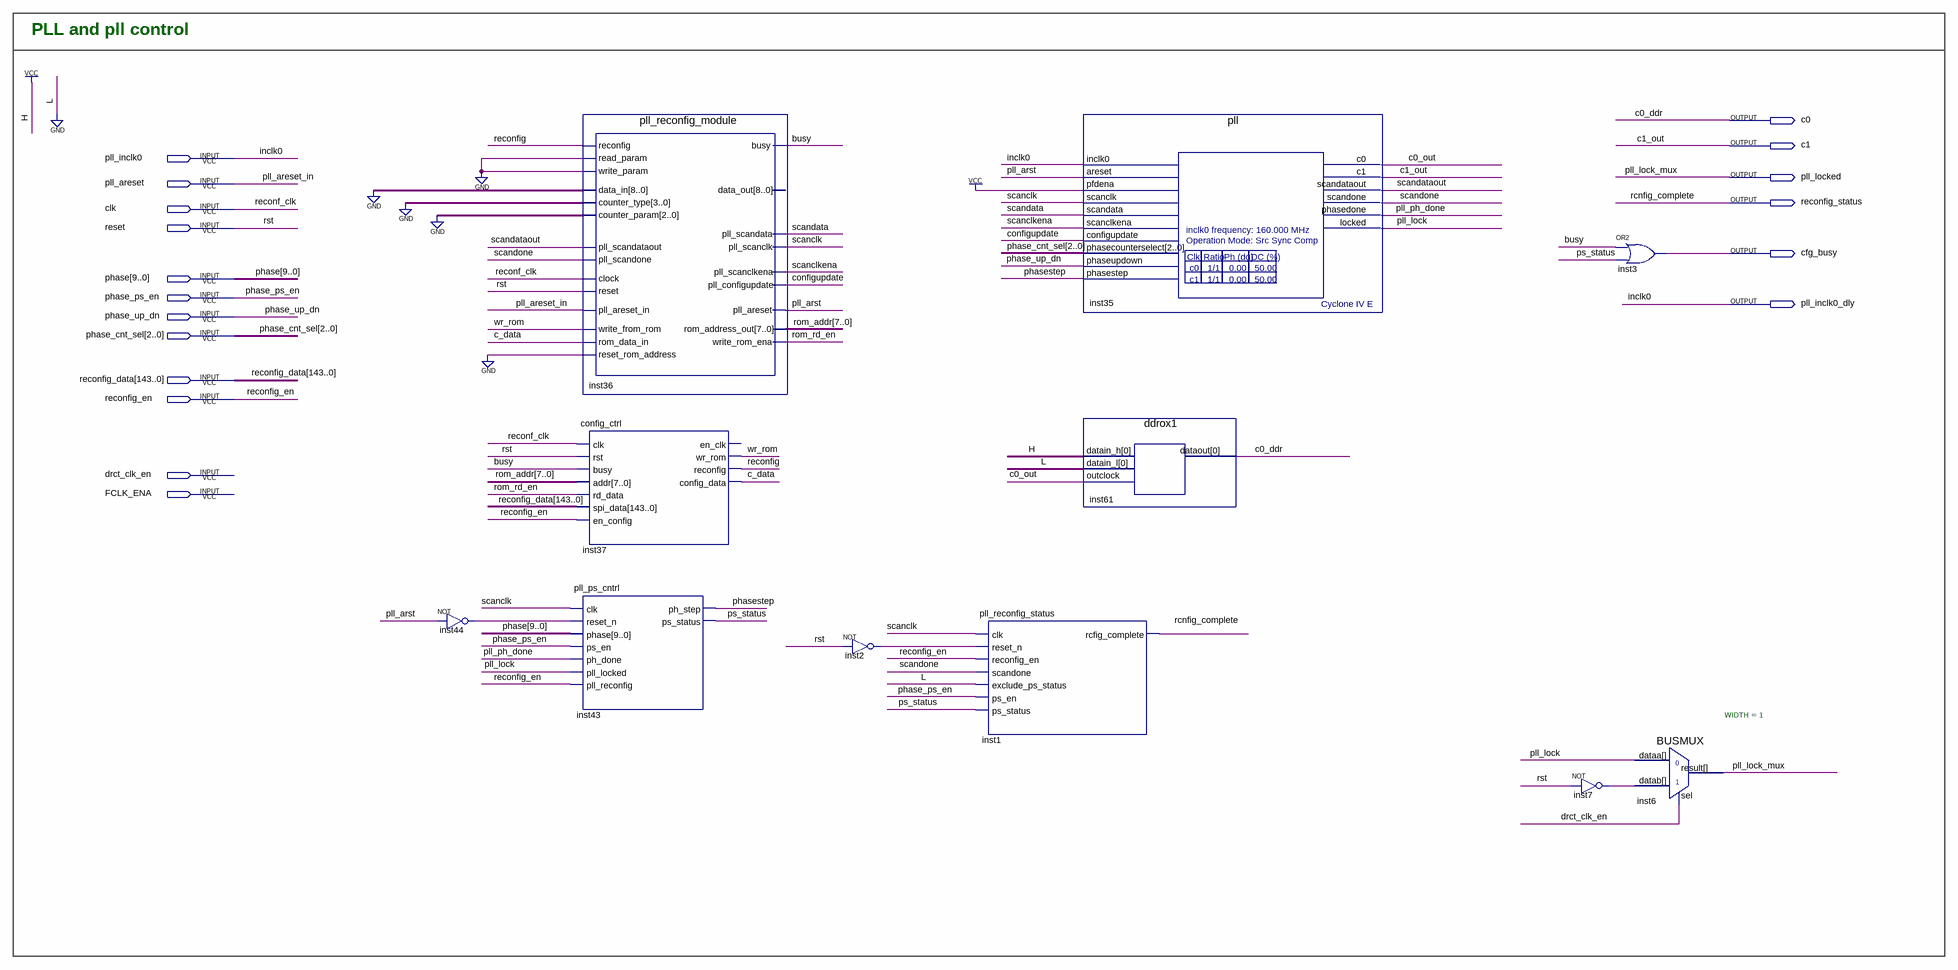
[diagram p0: schematic sheet]
// Quartus schematic pll_block_rx.bdf as structural Verilog: 11 symbols, 18 pins
module pll_block_rx (
  input  pll_inclk0,
  input  pll_areset,
  input  clk,
  input  reset,
  input  [9:0] phase,
  input  phase_ps_en,
  input  phase_up_dn,
  input  [2:0] phase_cnt_sel,
  input  [143:0] reconfig_data,
  input  reconfig_en,
  input  drct_clk_en,
  input  FCLK_ENA,
  output c0,
  output c1,
  output pll_locked,
  output reconfig_status,
  output cfg_busy,
  output pll_inclk0_dly
);

  wire busy, c0_out, c_data, configupdate, inst2_out, inst7_out, inst44_out, phasestep, pll_arst, pll_lock,
       pll_ph_done, ps_status, reconfig, rom_rd_en, scanclk, scanclkena, scandata, scandataout, scandone,
       wr_rom;
  wire [7:0] rom_addr;

  not inst44 (inst44_out, pll_arst);
  pll_reconfig_module inst36 (
    .reconfig(reconfig), .read_param(1'b0), .write_param(1'b0), .data_in({9{1'b0}}), .counter_type(4'b0000),
    .counter_param(3'b000), .pll_scandataout(scandataout), .pll_scandone(scandone), .clock(clk),
    .reset(reset), .pll_areset_in(pll_areset), .write_from_rom(wr_rom), .rom_data_in(c_data),
    .reset_rom_address(1'b0), .busy(busy), .pll_scandata(scandata), .pll_scanclk(scanclk),
    .pll_scanclkena(scanclkena), .pll_configupdate(configupdate), .pll_areset(pll_arst),
    .rom_address_out(rom_addr), .write_rom_ena(rom_rd_en));  // open: data_out
  config_ctrl inst37 (
    .clk(clk), .rst(reset), .busy(busy), .addr(rom_addr), .rd_data(rom_rd_en), .spi_data(reconfig_data),
    .en_config(reconfig_en), .wr_rom(wr_rom), .reconfig(reconfig), .config_data(c_data));  // open: en_clk
  pll_ps_cntrl inst43 (
    .clk(scanclk), .reset_n(inst44_out), .phase(phase), .ps_en(phase_ps_en), .ph_done(pll_ph_done),
    .pll_locked(pll_lock), .pll_reconfig(reconfig_en), .ph_step(phasestep), .ps_status(ps_status));
  not inst2 (inst2_out, reset);
  pll_reconfig_status inst1 (
    .clk(scanclk), .reset_n(inst2_out), .reconfig_en(reconfig_en), .scandone(scandone),
    .exclude_ps_status(1'b0), .ps_en(phase_ps_en), .ps_status(ps_status), .rcfig_complete(reconfig_status));
  pll inst35 (
    .inclk0(pll_inclk0), .areset(pll_arst), .pfdena(1'b1), .scanclk(scanclk), .scandata(scandata),
    .scanclkena(scanclkena), .configupdate(configupdate), .phasecounterselect(phase_cnt_sel),
    .phaseupdown(phase_up_dn), .phasestep(phasestep), .c0(c0_out), .c1(c1), .scandataout(scandataout),
    .scandone(scandone), .phasedone(pll_ph_done), .locked(pll_lock));
  ddrox1 inst61 (.datain_h(1'b1), .datain_l(1'b0), .outclock(c0_out), .dataout(c0));
  not inst7 (inst7_out, reset);
  or inst3 (cfg_busy, busy, ps_status);
  BUSMUX #(.WIDTH(1)) inst6 (.datab(inst7_out), .sel(drct_clk_en), .dataa(pll_lock), .result(pll_locked));

  assign pll_inclk0_dly = pll_inclk0;

  // Other names for the same wires on the sheet: c0_ddr = c0; c1_out = c1; inclk0 = pll_inclk0;
  //   pll_areset_in = pll_areset; pll_lock_mux = pll_locked; rcnfig_complete = reconfig_status; reconf_clk = clk;
  //   rst = reset

  // Notes on the sheet:
  //   PLL and pll control
endmodule
